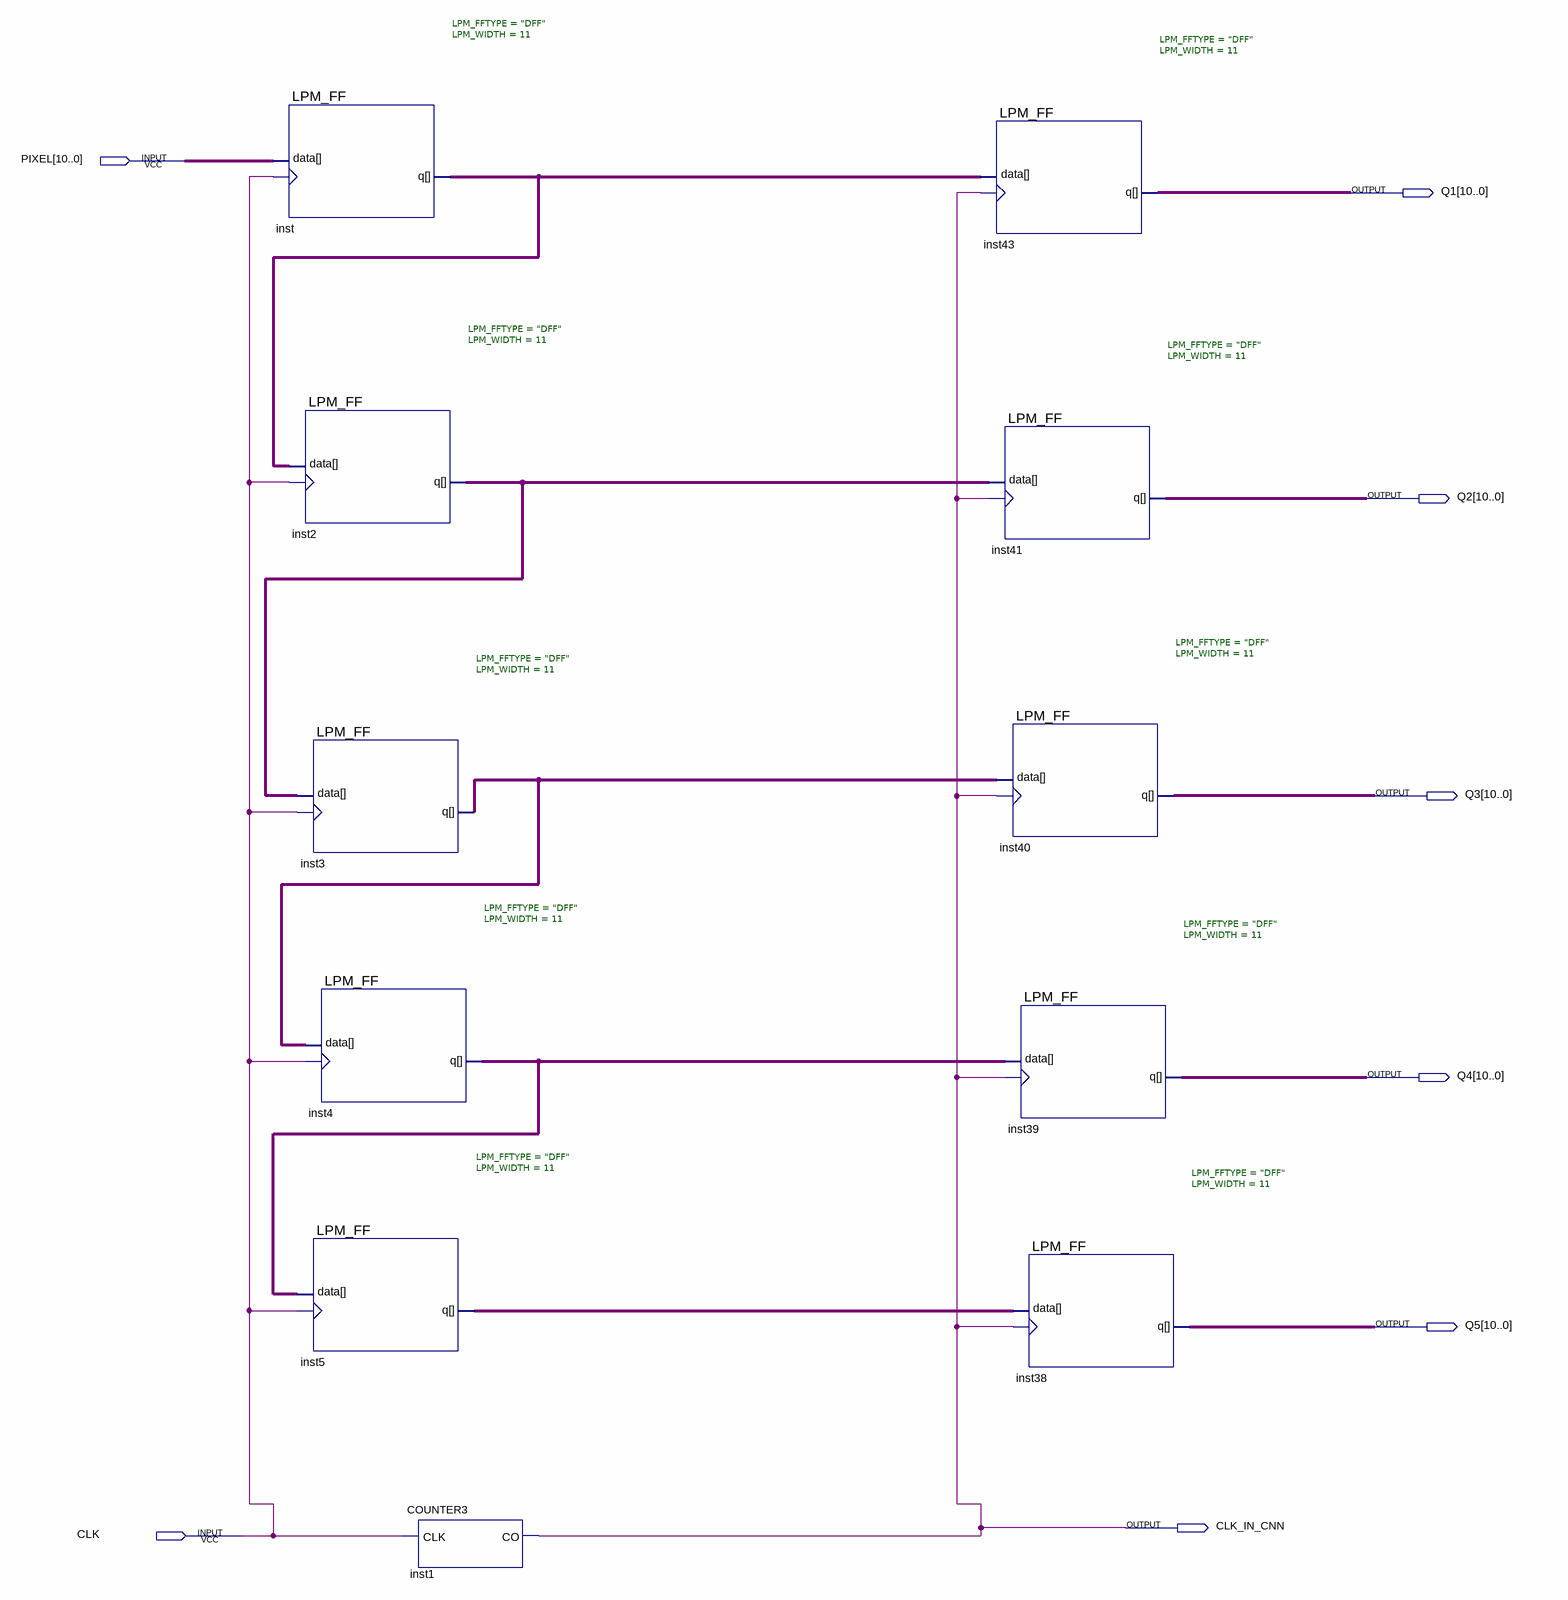
[diagram p0: schematic sheet]
// Quartus schematic SIPO.bdf as structural Verilog: 11 symbols, 8 pins
module SIPO (
  input  [10:0] PIXEL,
  input  CLK,
  output [10:0] Q1,
  output [10:0] Q2,
  output [10:0] Q3,
  output [10:0] Q4,
  output [10:0] Q5,
  output CLK_IN_CNN
);

  wire [10:0] inst2_q, inst3_q, inst4_q, inst5_q, inst_q;

  LPM_FF #(.LPM_FFTYPE("DFF"), .LPM_WIDTH(11)) inst (.clock(CLK), .data(PIXEL), .q(inst_q));
  LPM_FF #(.LPM_FFTYPE("DFF"), .LPM_WIDTH(11)) inst2 (.clock(CLK), .data(inst_q), .q(inst2_q));
  LPM_FF #(.LPM_FFTYPE("DFF"), .LPM_WIDTH(11)) inst3 (.clock(CLK), .data(inst2_q), .q(inst3_q));
  LPM_FF #(.LPM_FFTYPE("DFF"), .LPM_WIDTH(11)) inst4 (.clock(CLK), .data(inst3_q), .q(inst4_q));
  LPM_FF #(.LPM_FFTYPE("DFF"), .LPM_WIDTH(11)) inst5 (.clock(CLK), .data(inst4_q), .q(inst5_q));
  COUNTER3 inst1 (.CLK(CLK), .CO(CLK_IN_CNN));
  LPM_FF #(.LPM_FFTYPE("DFF"), .LPM_WIDTH(11)) inst43 (.clock(CLK_IN_CNN), .data(inst_q), .q(Q1));
  LPM_FF #(.LPM_FFTYPE("DFF"), .LPM_WIDTH(11)) inst41 (.clock(CLK_IN_CNN), .data(inst2_q), .q(Q2));
  LPM_FF #(.LPM_FFTYPE("DFF"), .LPM_WIDTH(11)) inst40 (.clock(CLK_IN_CNN), .data(inst3_q), .q(Q3));
  LPM_FF #(.LPM_FFTYPE("DFF"), .LPM_WIDTH(11)) inst39 (.clock(CLK_IN_CNN), .data(inst4_q), .q(Q4));
  LPM_FF #(.LPM_FFTYPE("DFF"), .LPM_WIDTH(11)) inst38 (.clock(CLK_IN_CNN), .data(inst5_q), .q(Q5));
endmodule
